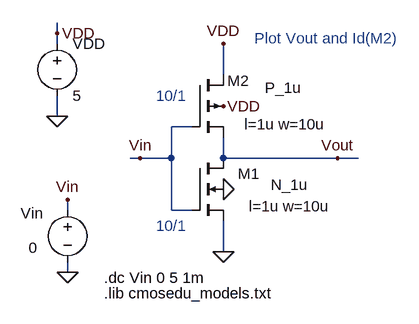
[diagram p0: schematic Fig11_4_long.asc]
Fig11_4_long.asc, the LTspice schematic file:
Version 4
SHEET 1 1136 680
WIRE 192 -368 192 -384
WIRE 192 -352 192 -368
WIRE 192 -240 192 -272
WIRE 208 -96 208 -112
WIRE 208 0 208 -16
WIRE 320 -176 304 -176
WIRE 368 -176 320 -176
WIRE 368 -176 368 -224
WIRE 368 -96 368 -176
WIRE 400 -224 368 -224
WIRE 400 -96 368 -96
WIRE 448 -304 448 -352
WIRE 448 -176 448 -208
WIRE 448 -32 448 -80
WIRE 624 -176 448 -176
WIRE 656 -176 624 -176
FLAG 208 0 0
FLAG 624 -176 Vout
FLAG 208 -112 Vin
FLAG 448 -128 0
FLAG 192 -240 0
FLAG 192 -368 VDD
FLAG 448 -256 VDD
FLAG 448 -32 0
FLAG 448 -352 VDD
FLAG 320 -176 Vin
SYMBOL nmos4 400 -176 R0
WINDOW 0 104 24 Right 0
WINDOW 3 179 41 Right 0
WINDOW 123 213 74 Right 0
SYMATTR InstName M1
SYMATTR Value N_1u
SYMATTR Value2 l=1u w=10u
SYMBOL voltage 208 -112 R0
WINDOW 0 -72 21 Left 0
WINDOW 3 -60 74 Left 0
WINDOW 123 0 0 Left 0
WINDOW 39 0 0 Left 0
SYMATTR InstName Vin
SYMATTR Value 0
SYMBOL voltage 192 -368 R0
WINDOW 123 0 0 Left 0
WINDOW 39 0 0 Left 0
SYMATTR InstName VDD
SYMATTR Value 5
SYMBOL pmos4 400 -304 R0
WINDOW 0 88 9 Right 0
WINDOW 3 168 20 Right 0
WINDOW 123 206 76 Right 0
SYMATTR InstName M2
SYMATTR Value P_1u
SYMATTR Value2 l=1u w=10u
TEXT 264 8 Left 0 !.dc Vin 0 5 1m
TEXT 264 32 Left 0 !.lib cmosedu_models.txt
TEXT 496 -360 Left 0 ;Plot Vout and Id(M2)
TEXT 344 -272 Left 0 ;10/1
TEXT 344 -72 Left 0 ;10/1

The netlist it stands for:
* Fig11_4_long.asc
M1 Vout Vin 0 0 N_1u l=1u w=10u
Vin Vin 0 0
VDD VDD 0 5
M2 VDD Vin Vout VDD P_1u l=1u w=10u
.model NMOS NMOS
.model PMOS PMOS
.lib standard.mos
.dc Vin 0 5 1m
.lib cmosedu_models.txt
* Plot Vout and Id(M2)
* 10/1
* 10/1
.backanno
.end